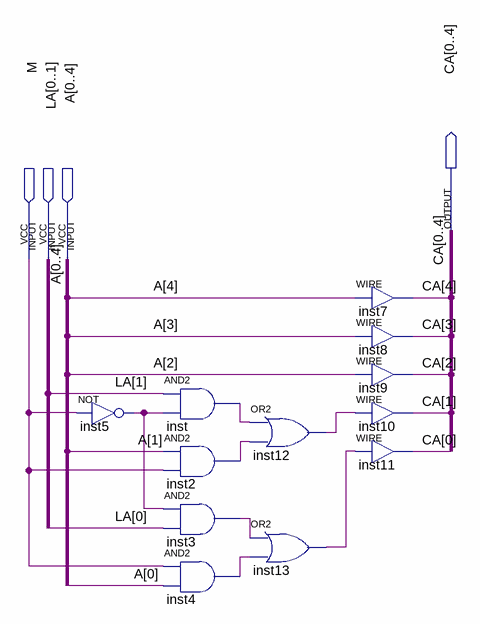
[diagram p0: schematic sheet]
// Quartus schematic Address_Combiner.bdf as structural Verilog: 12 symbols, 4 pins
module Address_Combiner (
  input  M,
  input  [0:1] LA,
  input  [0:4] A,
  output [0:4] CA
);

  wire inst2_out, inst3_out, inst4_out, inst5_out, inst12_out, inst13_out, inst_out;

  not inst5 (inst5_out, M);
  and inst (inst_out, LA[1], inst5_out);
  and inst2 (inst2_out, A[1], M);
  and inst3 (inst3_out, inst5_out, LA[0]);
  and inst4 (inst4_out, M, A[0]);
  or inst12 (inst12_out, inst_out, inst2_out);
  or inst13 (inst13_out, inst3_out, inst4_out);
  assign CA[4] = A[4];  // WIRE inst7
  assign CA[3] = A[3];  // WIRE inst8
  assign CA[2] = A[2];  // WIRE inst9
  assign CA[1] = inst12_out;  // WIRE inst10
  assign CA[0] = inst13_out;  // WIRE inst11
endmodule
